# Altium schematic sheet Peripherals.SchDoc
size A4; SheetNumber: 7; SheetTotal: 7
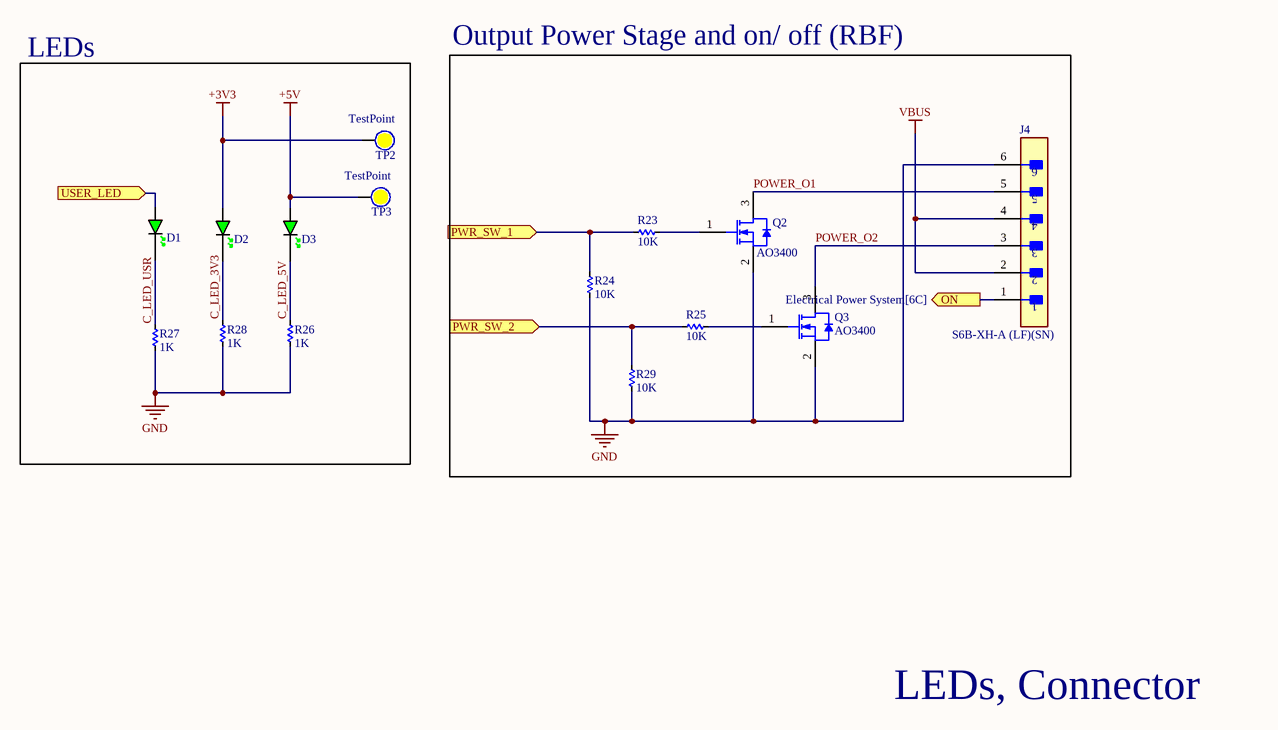
[diagram p0: Peripherals.SchDoc]

## Parts
D1  GREEN  [LED_0603_GREEN]  (value not drawn)
D2  GREEN  [LED_0603_GREEN]  (value not drawn)
D3  GREEN  [LED_0603_GREEN]  (value not drawn)
J4  S6B-XH-A (LF)(SN)  [FP-S6B-XH-A_LF_SN-MFG]
Q2  AO3400  [AO-SOT23-3_V]
Q3  AO3400  [AO-SOT23-3_V]
R23  10K  [RES-SMD-0805]
R24  10K  [RES-SMD-0805]
R25  10K  [RES-SMD-0805]
R26  1K  [RES-SMD-0805]
R27  1K  [RES-SMD-0805]
R28  1K  [RES-SMD-0805]
R29  10K  [RES-SMD-0805]
TP2  TestPoint  [Test Point 1 MM]  (no BOM)
TP3  TestPoint  [Test Point 1 MM]  (no BOM)

## Blocks framed on the sheet
LEDs: D1-D3 R26-R28 TP2 TP3
Output Power Stage and on/ off (RBF): J4 Q2 Q3 R23-R25 R29

## Ports
ON (out, see Electrical Power System[6C]), PWR_SW_1 (in, see Electrical Power System[6C], uC[3C]), PWR_SW_2 (in, see Electrical Power System[6C], uC[3C]), USER_LED (in, see Electrical Power System[6C], uC[3C])

## Nets
+3V3: D2.A TP2.0
+5V: D3.A TP3.0
GND: J4.6 Q2.2(S) Q3.2(S) R24.2 R26.2 R27.2 R28.2 R29.2
VBUS: J4.2 J4.4
C_LED_3V3: D2.K R28.2
C_LED_5V: D3.K R26.2
C_LED_USR: D1.K R27.2
ON: J4.1 ; port ON
POWER_O1: J4.5 Q2.3(D)
POWER_O2: J4.3 Q3.3(D)
PWR_SW_1: R23.1 R24.1 ; port PWR_SW_1
PWR_SW_2: R25.1 R29.1 ; port PWR_SW_2
USER_LED: D1.A ; port USER_LED
NetQ2_1: Q2.1(G) R23.2
NetQ3_1: Q3.1(G) R25.2

## Notes on the sheet
- LEDs, Connector

## Library data of the parts
D1-D3 = LED_0603_GREEN: LED 0603 GREEN SMD
J4 = CMP-17439-000165-2: CONN HEADER R/A 6POS 2.5MM; Number of Contacts: 6; Contact Resistance: 20mR; Max Current Rating: 3A; Max Voltage Rating (AC): 250V; Gender: Male; Insulation Resistance: 1GR; Wire/Cable Gauge: 22AWG; Fastening Type: Detent; Lead Pitch: 2.5mm; Flammability Rating: UL94 V-0; Contact Finish - Mating: TIN; Housing Material: Polyamide; Length: 17.4mm; Termination: Solder; Contact Type: Male Pin; Number of Positions: 6; Mount: Through Hole; Orientation: Right Angle; Voltage Rating (AC): 250V; Contact Shape: Square; Lead Free: Lead Free; Insulation Material: Nylon; Insulation Color: Natural; Contact Plating: Tin; Connector Type: Header; Housing Color: White; Color: Natural; Package Quantity: 500; Contact Material: Brass; Packaging: Bulk; Pitch: 2.5mm; Series: XH; Number of Rows: 1; Min Operating Temperature: -25°C; Voltage Rating: 250V; REACH SVHC: No SVHC; Current Rating: 3A; Depth: 11.5mm; Max Operating Temperature: 85°C
Q2 Q3 = CMP-0278-00001-1: N-channel Enhancement Mode Field-Effect Transistor; 5.8A/30V; Manufacturer: Alpha and Omega; Channel Type: N; Drain-Source Voltage Limit: 30 V; Junction Temperature: -55 to 150 degC; Gate-Source Voltage Limit: +/-12 V; PackageDescription: 3-Pin SOT23, 3.016 x 2.8 mm Body, 0.95 mm Pitch; ComponentLink2Description: Datasheet; DatasheetVersion: Rev.8, 12/2011; ComponentLink3URL: http://www.aosmd.com/res/packaging_information/SOT-23.pdf; Storage Temperature: -55 to 150 degC; ComponentLink3Description: Package Specification; PackageReference: SOT23; ComponentLink1Description: Manufacturer URL; Mounting Technology: Surface Mount; ComponentLink1URL: http://www.aosmd.com/; PartNumber: AO3400; ComponentLink2URL: http://www.aosmd.com/res/data_sheets/AO3400.pdf
R23-R29 = Res SMD: SMD; Manufacturer: Generic Components; Class: Passive; Published: 08/06/2000; Publisher: Altium Hobart Technology Centre
TP2 TP3 = Test Point: Solder: NF